# EAGLE design mSD-Shield-Mega_v10 (EAGLE 6.6.0)
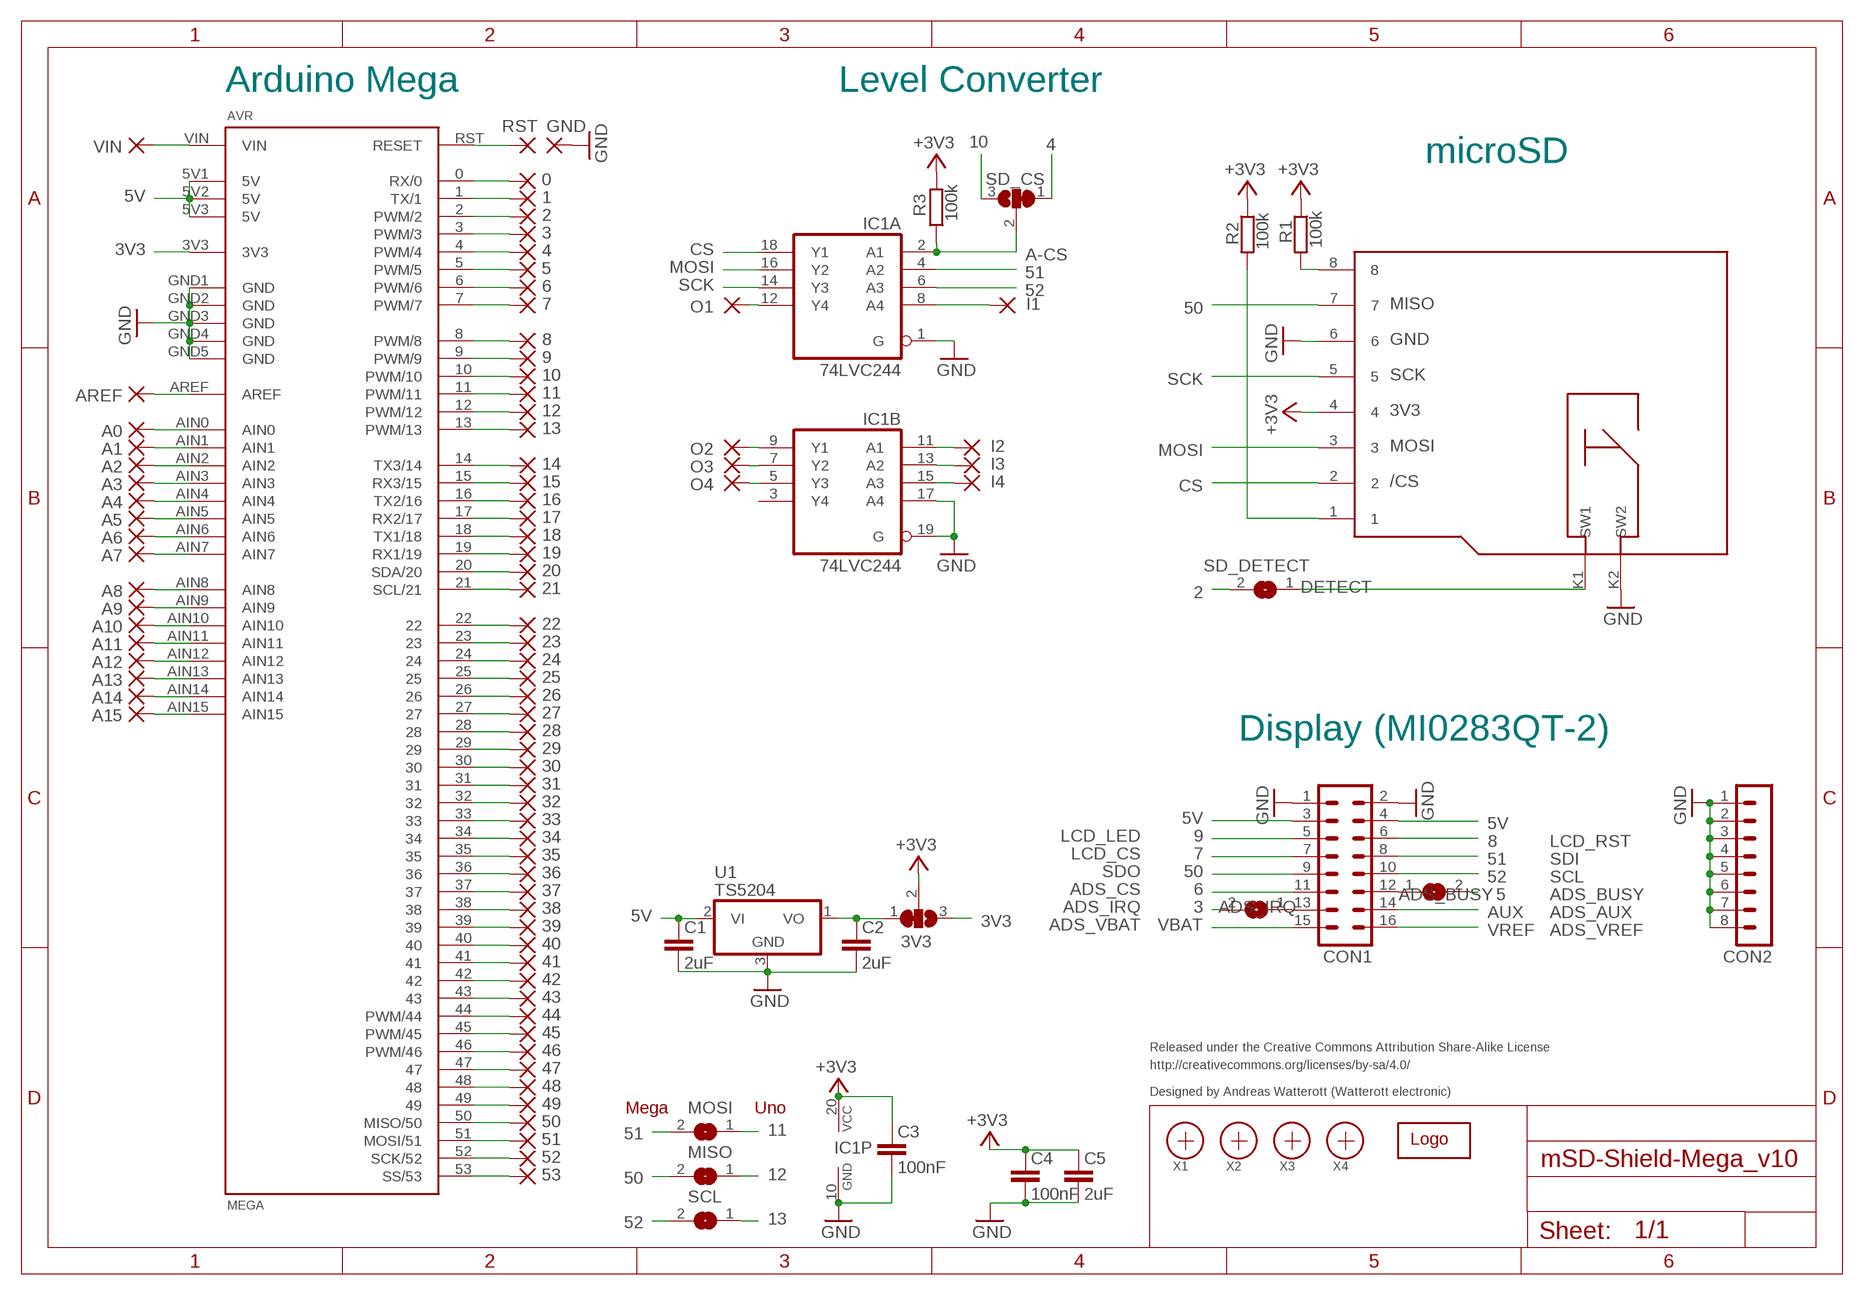
[diagram p0: schematic, sheet 1]

## Parts
0  1,6/0,8  [1,6/0,8]
1  1,6/0,8  [1,6/0,8]
2  1,6/0,8  [1,6/0,8]
3  1,6/0,8  [1,6/0,8]
3V3  SJ2W  [SJ_2]
4  1,6/0,8  [1,6/0,8]
5  1,6/0,8  [1,6/0,8]
6  1,6/0,8  [1,6/0,8]
7  1,6/0,8  [1,6/0,8]
8  1,6/0,8  [1,6/0,8]
9  1,6/0,8  [1,6/0,8]
10  1,6/0,8  [1,6/0,8]
11  1,6/0,8  [1,6/0,8]
12  1,6/0,8  [1,6/0,8]
13  1,6/0,8  [1,6/0,8]
14  1,6/0,8  [1,6/0,8]
15  1,6/0,8  [1,6/0,8]
16  1,6/0,8  [1,6/0,8]
17  1,6/0,8  [1,6/0,8]
18  1,6/0,8  [1,6/0,8]
19  1,6/0,8  [1,6/0,8]
20  1,6/0,8  [1,6/0,8]
21  1,6/0,8  [1,6/0,8]
22  1,6/0,8  [1,6/0,8]
23  1,6/0,8  [1,6/0,8]
24  1,6/0,8  [1,6/0,8]
25  1,6/0,8  [1,6/0,8]
26  1,6/0,8  [1,6/0,8]
27  1,6/0,8  [1,6/0,8]
28  1,6/0,8  [1,6/0,8]
29  1,6/0,8  [1,6/0,8]
30  1,6/0,8  [1,6/0,8]
31  1,6/0,8  [1,6/0,8]
32  1,6/0,8  [1,6/0,8]
33  1,6/0,8  [1,6/0,8]
34  1,6/0,8  [1,6/0,8]
35  1,6/0,8  [1,6/0,8]
36  1,6/0,8  [1,6/0,8]
37  1,6/0,8  [1,6/0,8]
38  1,6/0,8  [1,6/0,8]
39  1,6/0,8  [1,6/0,8]
40  1,6/0,8  [1,6/0,8]
41  1,6/0,8  [1,6/0,8]
42  1,6/0,8  [1,6/0,8]
43  1,6/0,8  [1,6/0,8]
44  1,6/0,8  [1,6/0,8]
45  1,6/0,8  [1,6/0,8]
46  1,6/0,8  [1,6/0,8]
47  1,6/0,8  [1,6/0,8]
48  1,6/0,8  [1,6/0,8]
49  1,6/0,8  [1,6/0,8]
50  1,6/0,8  [1,6/0,8]
51  1,6/0,8  [1,6/0,8]
52  1,6/0,8  [1,6/0,8]
53  1,6/0,8  [1,6/0,8]
A0  1,6/0,8  [1,6/0,8]
A1  1,6/0,8  [1,6/0,8]
A2  1,6/0,8  [1,6/0,8]
A3  1,6/0,8  [1,6/0,8]
A4  1,6/0,8  [1,6/0,8]
A5  1,6/0,8  [1,6/0,8]
A6  1,6/0,8  [1,6/0,8]
A7  1,6/0,8  [1,6/0,8]
A8  1,6/0,8  [1,6/0,8]
A9  1,6/0,8  [1,6/0,8]
A10  1,6/0,8  [1,6/0,8]
A11  1,6/0,8  [1,6/0,8]
A12  1,6/0,8  [1,6/0,8]
A13  1,6/0,8  [1,6/0,8]
A14  1,6/0,8  [1,6/0,8]
A15  1,6/0,8  [1,6/0,8]
ADS_BUSY  SJ  [SJ]
ADS_IRQ  SJ  [SJ]
AREF  1,6/0,8  [1,6/0,8]
AVR  MEGA  [MEGA]
C1  2uF  C-EUC0805  [C0805]
C2  2uF  C-EUC0805  [C0805]
C3  100nF  C-EUC0603  [C0603]
C4  100nF  C-EUC0603  [C0603]
C5  2uF  C-EUC0603  [C0603]
CON1  MA08-2  [MA08-2]
CON2  MA08-1  [MA08-1]
GND  SMD2  [SMD1,27-2,54]
I1  SMD2  [SMD1,27-2,54]
I2  SMD2  [SMD1,27-2,54]
I3  SMD2  [SMD1,27-2,54]
I4  SMD2  [SMD1,27-2,54]
IC1  74LVC244  74HC244DW  [SO20W]
MISO  SJ  [SJ]
MOSI  SJ  [SJ]
O1  SMD2  [SMD1,27-2,54]
O2  SMD2  [SMD1,27-2,54]
O3  SMD2  [SMD1,27-2,54]
O4  SMD2  [SMD1,27-2,54]
R1  100k  R-EU_R0603  [R0603]
R2  100k  R-EU_R0603  [R0603]
R3  100k  R-EU_R0603  [R0603]
RST  SMD2  [SMD1,27-2,54]
SCL  SJ  [SJ]
SD_CS  SJ2W  [SJ_2]
SD_DETECT  SJ  [SJ]
U1  TS5204  [SOT23]
U$1  WE-LOGO  [WE-LOGO]
VIN  1,6/0,8  [1,6/0,8]
X1  PASSER  [PASSER]
X2  PASSER  [PASSER]
X3  PASSER  [PASSER]
X4  PASSER  [PASSER]
X5  MICRO-SD  [MICRO-SD]

## Nets
0: 0.1(P) AVR.0(RX/0)
1: 1.1(P) AVR.1(TX/1)
2: 2.1(P) AVR.2(PWM/2) SD_DETECT.2
3: 3.1(P) ADS_IRQ.2 AVR.3(PWM/3)
3V3: 3V3.3 AVR.3V3
3V_OUT: 3V3.1 C2.1 U1.1(VO)
4: 4.1(P) AVR.4(PWM/4) SD_CS.1
5: 5.1(P) ADS_BUSY.2 AVR.5(PWM/5)
5V: AVR.5V1(5V) AVR.5V2(5V) AVR.5V3(5V) C1.1 CON1.3 CON1.4 U1.2(VI)
6: 6.1(P) AVR.6(PWM/6) CON1.11
7: 7.1(P) AVR.7(PWM/7) CON1.7
8: 8.1(P) AVR.8(PWM/8) CON1.6
9: 9.1(P) AVR.9(PWM/9) CON1.5
10: 10.1(P) AVR.10(PWM/10) SD_CS.3
11: 11.1(P) AVR.11(PWM/11) MOSI.1
12: 12.1(P) AVR.12(PWM/12) MISO.1
13: 13.1(P) AVR.13(PWM/13) SCL.1
14: 14.1(P) AVR.14(TX3/14)
15: 15.1(P) AVR.15(RX3/15)
16: 16.1(P) AVR.16(TX2/16)
17: 17.1(P) AVR.17(RX2/17)
18: 18.1(P) AVR.18(TX1/18)
19: 19.1(P) AVR.19(RX1/19)
20: 20.1(P) AVR.20(SDA/20)
21: 21.1(P) AVR.21(SCL/21)
22: 22.1(P) AVR.22
23: 23.1(P) AVR.23
24: 24.1(P) AVR.24
25: 25.1(P) AVR.25
26: 26.1(P) AVR.26
27: 27.1(P) AVR.27
28: 28.1(P) AVR.28
29: 29.1(P) AVR.29
30: 30.1(P) AVR.30
31: 31.1(P) AVR.31
32: 32.1(P) AVR.32
33: 33.1(P) AVR.33
34: 34.1(P) AVR.34
35: 35.1(P) AVR.35
36: 36.1(P) AVR.36
37: 37.1(P) AVR.37
38: 38.1(P) AVR.38
39: 39.1(P) AVR.39
40: 40.1(P) AVR.40
41: 41.1(P) AVR.41
42: 42.1(P) AVR.42
43: 43.1(P) AVR.43
44: 44.1(P) AVR.44(PWM/44)
45: 45.1(P) AVR.45(PWM/45)
46: 46.1(P) AVR.46(PWM/46)
47: 47.1(P) AVR.47
48: 48.1(P) AVR.48
49: 49.1(P) AVR.49
50: 50.1(P) AVR.50(MISO/50) CON1.9 MISO.2 X5.7
51: 51.1(P) AVR.51(MOSI/51) CON1.8 IC1.4(A:A2) MOSI.2
52: 52.1(P) AVR.52(SCK/52) CON1.10 IC1.6(A:A3) SCL.2
53: 53.1(P) AVR.53(SS/53)
+3V3: 3V3.2 C3.1 C4.1 C5.1 IC1.20(P:VCC) R1.1 R2.1 R3.2 X5.4
A-CS: IC1.2(A:A1) R3.1 SD_CS.2
ADS_BUSY: ADS_BUSY.1 CON1.12
ADS_IRQ: ADS_IRQ.1 CON1.13
AIN0: A0.1(P) AVR.AIN0
AIN1: A1.1(P) AVR.AIN1
AIN2: A2.1(P) AVR.AIN2
AIN3: A3.1(P) AVR.AIN3
AIN4: A4.1(P) AVR.AIN4
AIN5: A5.1(P) AVR.AIN5
AIN6: A6.1(P) AVR.AIN6
AIN7: A7.1(P) AVR.AIN7
AIN8: A8.1(P) AVR.AIN8
AIN9: A9.1(P) AVR.AIN9
AIN10: A10.1(P) AVR.AIN10
AIN11: A11.1(P) AVR.AIN11
AIN12: A12.1(P) AVR.AIN12
AIN13: A13.1(P) AVR.AIN13
AIN14: A14.1(P) AVR.AIN14
AIN15: A15.1(P) AVR.AIN15
AUX: CON1.14
CS: IC1.18(A:Y1) X5.2
DETECT: SD_DETECT.1 X5.K1(SW1)
GND: AVR.GND1(GND) AVR.GND2(GND) AVR.GND3(GND) AVR.GND4(GND) AVR.GND5(GND) C1.2 C2.2 C3.2 C4.2 C5.2 CON1.1 CON1.2 CON2.1 CON2.2 CON2.3 CON2.4 CON2.5 CON2.6 CON2.7 CON2.8 GND.1(P) IC1.1(A:G) IC1.10(P:GND) IC1.17(B:A4) IC1.19(B:G) U1.3(GND) X5.6 X5.K2(SW2)
I-1: I1.1(P) IC1.8(A:A4)
I-2: I2.1(P) IC1.11(B:A1)
I-3: I3.1(P) IC1.13(B:A2)
I-4: I4.1(P) IC1.15(B:A3)
MOSI: IC1.16(A:Y2) X5.3
N$16: R2.2 X5.1
N$17: R1.2 X5.8
N$18: AVR.VIN VIN.1(P)
N$50: AREF.1(P) AVR.AREF
O-1: IC1.12(A:Y4) O1.1(P)
O-2: IC1.9(B:Y1) O2.1(P)
O-3: IC1.7(B:Y2) O3.1(P)
O-4: IC1.5(B:Y3) O4.1(P)
RST: AVR.RST(RESET) RST.1(P)
SCK: IC1.14(A:Y3) X5.5
VBAT: CON1.15
VREF: CON1.16
Unconnected: IC1.3(B:Y4)

## Notes on the sheet
- Arduino Mega | Level Converter
- microSD
- Display (MI0283QT-2)
- LCD_LED
- LCD_CS | LCD_RST
- SDO | SDI
- ADS_CS | SCL
- ADS_IRQ | ADS_BUSY
- ADS_VBAT | ADS_AUX
- ADS_VREF
- Released under the Creative Commons Attribution Share-Alike License
- http://creativecommons.org/licenses/by-sa/4.0/
- Designed by Andreas Watterott (Watterott electronic)
- Mega | Uno

## Library data of the parts
0 1-53 A0 A1-A15 AREF VIN = wirepad:1,6/0,8: THROUGH-HOLE PAD
3V3 SD_CS = jumper:SJ2W: SMD solder JUMPER
ADS_BUSY ADS_IRQ MISO MOSI SCL SD_DETECT = jumper:SJ: SMD solder JUMPER
AVR = Arduino:MEGA: Arduino MEGA
C1-C5 = rcl:C-EU: CAPACITOR, European symbol
CON1 = con-lstb:MA08-2: PIN HEADER
CON2 = con-lstb:MA08-1: PIN HEADER
GND I1-I4 O1-O4 RST = wirepad:SMD2: SMD PAD
IC1 = 74xx-eu:74*244: Octal BUFFER and LINE DRIVER, 3-state
R1-R3 = rcl:R-EU_: RESISTOR, European symbol
U1 = Voltage-Reg:TS5204
U$1 = welectronic:WE-LOGO
X1-X4 = SMD:PASSER
X5 = SD-Card:MICRO-SD

## Board
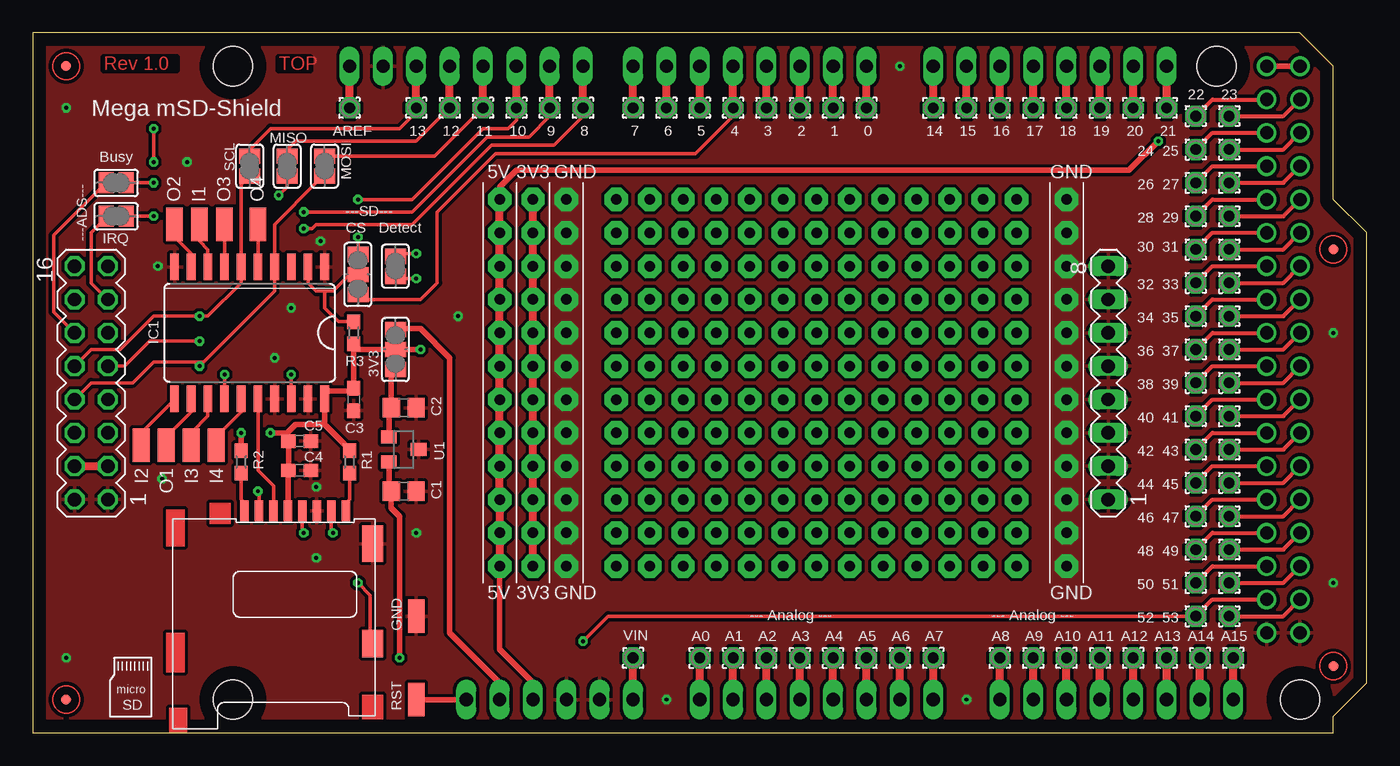
[diagram p1: board, top side]
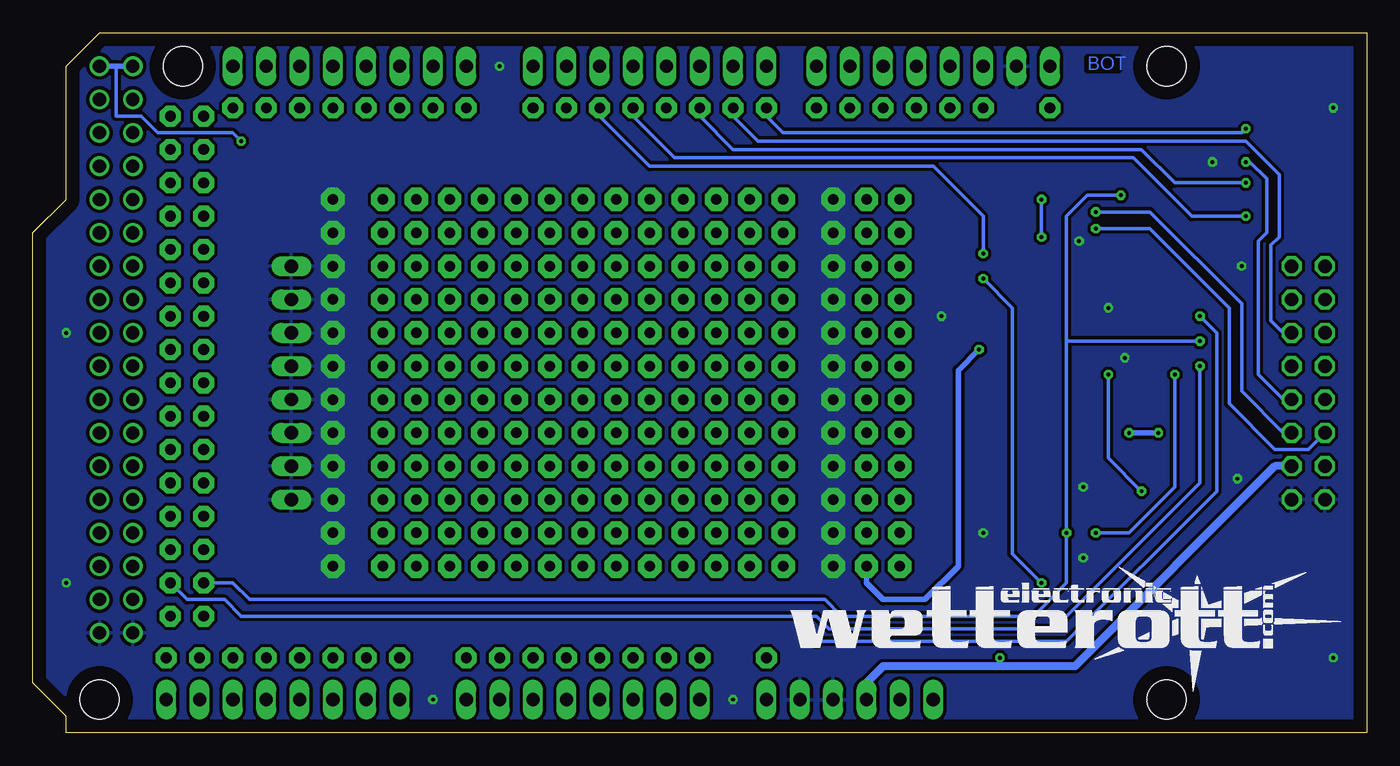
[diagram p2: board, bottom side, seen from below]

Size 101.6 x 53.34 mm. Coordinates in mm from the lower left corner, seen from the top.
Copper layers (1*16): Top 0.035mm / dielectric 1.5mm / Bottom 0.035mm
Design rules "default *": minimum track width 10mil, minimum drill 0.3mm, track to track 8mil, track to pad 8mil, pad to pad 8mil, via to via 8mil, smd to smd 8mil, copper to edge 40mil, drill to drill 8mil, minimum pad ring 10mil, minimum via ring 8mil, stop-mask expansion 4mil, vias tented up to drill 0.5mm, thermal gap 10mil

### Footprints (pad centres in the part's own frame; a part is rotated, then mirrored left to right if it is on the bottom)
1,6/0,8 = drill 0.813 pad 1.6 octagon: 1 0,0
SJ_2 = smd 1.168 x 1.6: 1 -1.524,0; 2 0,0; 3 1.524,0
SJ = smd 1.168 x 1.6: 1 -0.762,0; 2 0.762,0
MEGA = drill 1 long: 0 63.5,50.8; 1 60.96,50.8; 2 58.42,50.8; 3 55.88,50.8; 3V3 35.56,2.54; 4 53.34,50.8; 5 50.8,50.8; 5V1 38.1,2.54; 6 48.26,50.8; 7 45.72,50.8; 8 41.91,50.8; 9 39.37,50.8; 10 36.83,50.8; 11 34.29,50.8; 12 31.75,50.8; 13 29.21,50.8; 14 68.58,50.8; 15 71.12,50.8; 16 73.66,50.8; 17 76.2,50.8; 18 78.74,50.8; 19 81.28,50.8; 20 83.82,50.8; 21 86.36,50.8; AIN0 50.8,2.54; AIN1 53.34,2.54; AIN2 55.88,2.54; AIN3 58.42,2.54; AIN4 60.96,2.54; AIN5 63.5,2.54; AIN6 66.04,2.54; AIN7 68.58,2.54; AIN8 73.66,2.54; AIN9 76.2,2.54; AIN10 78.74,2.54; AIN11 81.28,2.54; AIN12 83.82,2.54; AIN13 86.36,2.54; AIN14 88.9,2.54; AIN15 91.44,2.54; AREF 24.13,50.8; GND1 40.64,2.54; GND2 43.18,2.54; GND3 26.67,50.8; RST 33.02,2.54; VIN 45.72,2.54 | drill 1: 5V2 93.98,50.8; 5V3 96.52,50.8; 22 93.98,48.26; 23 96.52,48.26; 24 93.98,45.72; 25 96.52,45.72; 26 93.98,43.18; 27 96.52,43.18; 28 93.98,40.64; 29 96.52,40.64; 30 93.98,38.1; 31 96.52,38.1; 32 93.98,35.56; 33 96.52,35.56; 34 93.98,33.02; 35 96.52,33.02; 36 93.98,30.48; 37 96.52,30.48; 38 93.98,27.94; 39 96.52,27.94; 40 93.98,25.4; 41 96.52,25.4; 42 93.98,22.86; 43 96.52,22.86; 44 93.98,20.32; 45 96.52,20.32; 46 93.98,17.78; 47 96.52,17.78; 48 93.98,15.24; 49 96.52,15.24; 50 93.98,12.7; 51 96.52,12.7; 52 93.98,10.16; 53 96.52,10.16; GND4 93.98,7.62; GND5 96.52,7.62 | hole 3: 90.17,50.8; 96.52,2.54; 15.24,50.8; 15.24,2.54
C0805 = smd 1.3 x 1.5: 1 -0.95,0; 2 0.95,0
C0603 = smd 1.1 x 1: 1 -0.85,0; 2 0.85,0
MA08-2 = drill 1.016 octagon: 1 -8.89,-1.27; 2 -8.89,1.27; 3 -6.35,-1.27; 4 -6.35,1.27; 5 -3.81,-1.27; 6 -3.81,1.27; 7 -1.27,-1.27; 8 -1.27,1.27; 9 1.27,-1.27; 10 1.27,1.27; 11 3.81,-1.27; 12 3.81,1.27; 13 6.35,-1.27; 14 6.35,1.27; 15 8.89,-1.27; 16 8.89,1.27
MA08-1 = drill 1.016 long: 1 -8.89,0; 2 -6.35,0; 3 -3.81,0; 4 -1.27,0; 5 1.27,0; 6 3.81,0; 7 6.35,0; 8 8.89,0
SMD1,27-2,54 = smd 1.27 x 2.54: 1 0,0
SO20W = smd 0.66 x 2.032: 1 -5.715,-5.029; 2 -4.445,-5.029; 3 -3.175,-5.029; 4 -1.905,-5.029; 5 -0.635,-5.029; 6 0.635,-5.029; 7 1.905,-5.029; 8 3.175,-5.029; 9 4.445,-5.029; 10 5.715,-5.029; 11 5.715,5.029; 12 4.445,5.029; 13 3.175,5.029; 14 1.905,5.029; 15 0.635,5.029; 16 -0.635,5.029; 17 -1.905,5.029; 18 -3.175,5.029; 19 -4.445,5.029; 20 -5.715,5.029
R0603 = smd 1.1 x 1: 1 -0.85,0; 2 0.85,0
SOT23 = smd 1 x 1.2: 1 -0.95,-1.132; 2 0.95,-1.132; 3 0,1.132
PASSER = smd 0.762 x 0.762: X 0,0
MICRO-SD = smd 0.65 x 1.6: 1 -10.54,16.6; 2 -9.44,16.6; 3 -8.34,16.6; 4 -7.24,16.6; 5 -6.14,16.6; 6 -5.04,16.6; 7 -3.94,16.6; 8 -2.84,16.6 | smd 1.6 x 2.1: K1 -0.8,6.5 | smd 1.6 x 2.8: K2 -0.8,14.1

### Placement (x,y rotation side)
0  63.5,47.62 0 top
1  60.96,47.62 0 top
2  58.42,47.62 0 top
3  55.88,47.62 0 top
3V3  27.62,29.21 90 top
4  53.34,47.62 0 top
5  50.8,47.62 0 top
6  48.26,47.62 0 top
7  45.72,47.62 0 top
8  41.91,47.62 0 top
9  39.37,47.62 0 top
10  36.83,47.62 0 top
11  34.29,47.62 0 top
12  31.75,47.62 0 top
13  29.21,47.62 0 top
14  68.58,47.62 180 top
15  71.12,47.62 180 top
16  73.66,47.62 180 top
17  76.2,47.62 180 top
18  78.74,47.62 180 top
19  81.28,47.62 180 top
20  83.82,47.62 180 top
21  86.36,47.62 180 top
22  88.58,46.99 90 top
23  91.12,46.99 90 top
24  88.58,44.45 90 top
25  91.12,44.45 90 top
26  88.58,41.91 90 top
27  91.12,41.91 90 top
28  88.58,39.37 90 top
29  91.12,39.37 90 top
30  88.58,36.83 90 top
31  91.12,36.83 90 top
32  88.58,34.29 90 top
33  91.12,34.29 90 top
34  88.58,31.75 90 top
35  91.12,31.75 90 top
36  88.58,29.21 90 top
37  91.12,29.21 90 top
38  88.58,26.67 90 top
39  91.12,26.67 90 top
40  88.58,24.13 90 top
41  91.12,24.13 90 top
42  88.58,21.59 90 top
43  91.12,21.59 90 top
44  88.58,19.05 90 top
45  91.12,19.05 90 top
46  88.58,16.51 90 top
47  91.12,16.51 90 top
48  88.58,13.97 90 top
49  91.12,13.97 90 top
50  88.58,11.43 90 top
51  91.12,11.43 90 top
52  88.58,8.89 90 top
53  91.12,8.89 90 top
A0  50.8,5.71 180 top
A1  53.34,5.71 180 top
A2  55.88,5.71 180 top
A3  58.42,5.71 180 top
A4  60.96,5.71 180 top
A5  63.5,5.71 180 top
A6  66.04,5.71 0 top
A7  68.58,5.71 0 top
A8  73.66,5.71 0 top
A9  76.2,5.71 0 top
A10  78.74,5.71 0 top
A11  81.28,5.71 0 top
A12  83.82,5.71 0 top
A13  86.36,5.71 0 top
A14  88.9,5.71 0 top
A15  91.44,5.71 0 top
ADS_BUSY  6.35,41.91 0 top
ADS_IRQ  6.35,39.37 0 top
AREF  24.13,47.62 0 top
AVR  0,0 0 top
C1  28.26,18.41 0 top
C2  28.26,24.77 0 top
C3  24.45,25.4 270 top
C4  20.32,20 0 top
C5  20.32,22.23 0 top
CON1  4.45,26.67 90 top
CON2  81.92,26.67 90 top
GND  29.21,8.89 0 top
I1  12.7,38.73 0 top
I2  8.26,21.91 0 top
I3  12.06,21.91 0 top
I4  13.97,21.91 0 top
IC1  16.51,30.48 180 top
MISO  19.37,43.18 270 top
MOSI  22.23,43.18 270 top
O1  10.16,21.91 0 top
O2  10.79,38.73 0 top
O3  14.61,38.73 0 top
O4  17.14,38.73 0 top
R1  24.13,20.64 270 top
R2  15.88,20.64 270 top
R3  24.45,30.48 270 top
RST  29.21,2.54 0 top
SCL  16.51,43.18 270 top
SD_CS  24.77,34.92 90 top
SD_DETECT  27.62,35.56 90 top
U1  28.26,21.59 270 top
U$1  44.13,2.86 0 bottom
VIN  45.72,5.71 0 top
X1  2.54,2.54 0 top
X2  2.54,50.8 0 top
X3  99.06,36.83 0 top
X4  99.06,5.08 0 top
X5  26.67,0.32 0 top

### Tracks (layer width: path | path; a pad name or v marks a point on that pad's centre or on a via)
0
  Top 0.61: 0.1 AVR.0
1
  Top 0.61: 1.1 AVR.1
2  (via drill 0.3)
  Top 0.254: v29.21,36.51 27.81,36.51 SD_DETECT.2
  Top 0.61: 2.1 AVR.2
  Bottom 0.254: v29.21,36.51 29.21,39.37 33.02,43.18 54.61,43.18 58.42,46.99 2.1
3  (via drill 0.3)
  Top 0.254: ADS_IRQ.2 v9.21,39.37
  Top 0.61: 3.1 AVR.3
  Bottom 0.254: v9.21,39.37 13.34,39.37 17.78,43.81 52.7,43.81 55.88,46.99 3.1
3V3
  Top 0.254: 27.69,30.8 3V3.3
  Top 0.406: 27.69,30.8 29.53,30.8 31.75,28.57 31.75,7.62 35.56,3.81 AVR.3V3
3V_OUT
  Top 0.254: 27.13,24.58 C2.1 | 27.31,27.37 3V3.1
  Top 0.406: U1.1 27.13,24.58 | C2.1 27.31,27.37
4
  Top 0.254: SD_CS.1 24.77,33.02 29.53,33.02 30.8,34.29 30.8,39.69 35.24,44.13 50.48,44.13 53.34,46.99 4.1
  Top 0.61: 4.1 AVR.4
5  (via drill 0.3)
  Top 0.254: ADS_BUSY.2 v9.21,41.91
  Top 0.61: 5.1 AVR.5
  Bottom 0.254: v9.21,41.91 14.61,41.91 17.14,44.45 48.26,44.45 50.8,46.99 5.1
5V  (via drill 0.3, 0.8 pad 1.78)
  Top 0.254: C1.1 27.13,18.6
  Top 0.406: 27.13,18.6 U1.2 | C1.1 27.31,17.14 27.94,16.51 v27.94,5.71 | v35.56,17.78 35.56,6.35 38.1,3.81 AVR.5V1 | AVR.5V2 AVR.5V3 | v35.56,40.64 35.56,41.59 36.83,42.86 83.5,42.86 v85.72,45.09
  Top 0.61: CON1.4 CON1.3 | v35.56,12.7 v35.56,15.24 v35.56,17.78 v35.56,20.32 v35.56,22.86 v35.56,25.4 v35.56,27.94 v35.56,30.48 v35.56,33.02 v35.56,35.56 v35.56,38.1 v35.56,40.64
  Bottom 0.254: 95.25,50.8 95.25,46.99 93.34,46.99 92.08,45.72 86.36,45.72 v85.72,45.09
  Bottom 0.406: AVR.5V2 95.25,50.8 AVR.5V3 | 27.94,5.08 v27.94,5.71
  Bottom 0.61: CON1.3 6.99,20.32 22.23,5.08 27.94,5.08 36.83,5.08 38.1,3.81 AVR.5V1
6
  Top 0.61: 6.1 AVR.6
  Bottom 0.254: CON1.11 6.35,30.48 7.3,31.43 7.3,37.15 6.67,37.78 6.67,42.55 9.21,45.09 46.35,45.09 48.26,46.99 6.1
7  (via drill 0.3)
  Top 0.254: v9.21,43.5 v9.21,46.04
  Top 0.61: 7.1 AVR.7
  Bottom 0.254: CON1.7 6.35,25.4 8.26,27.3 8.26,37.47 7.62,38.1 7.62,42.23 8.89,43.5 v9.21,43.5 | v9.21,46.04 9.53,45.72 44.45,45.72 45.72,46.99 7.1
8  (via drill 0.3)
  Top 0.254: v20.64,38.42 21.27,38.42 21.59,38.73 28.89,38.73 34.92,44.77 39.69,44.77 41.91,46.99 8.1
  Top 0.61: 8.1 AVR.8
  Bottom 0.254: CON1.6 4.45,21.59 6.99,21.59 10.48,25.08 10.48,32.38 16.51,38.42 v20.64,38.42
9  (via drill 0.3)
  Top 0.254: v20.64,39.69 28.89,39.69 34.61,45.4 37.78,45.4 39.37,46.99 9.1
  Top 0.61: 9.1 AVR.9
  Bottom 0.254: CON1.5 6.35,22.86 9.53,26.04 9.53,32.7 16.51,39.69 v20.64,39.69
10  (via drill 0.3)
  Top 0.254: v24.77,40.64 28.89,40.64 34.29,46.04 36.2,46.04 36.83,46.67 10.1 | SD_CS.3 v24.77,37.78
  Top 0.61: 10.1 AVR.10
  Bottom 0.254: v24.77,37.78 v24.77,40.64
11
  Top 0.254: MOSI.1 30.61,43.94 11.1
  Top 0.61: 11.1 AVR.11
12
  Top 0.254: MISO.1 19.37,44.45 20,45.09 29.21,45.09 12.1
  Top 0.61: 12.1 AVR.12
13
  Top 0.254: 13.1 29.21,47.31 27.94,46.04 18.1,46.04 16.51,44.45 SCL.1
  Top 0.61: 13.1 AVR.13
14
  Top 0.61: 14.1 AVR.14
15
  Top 0.61: 15.1 AVR.15
16
  Top 0.61: 16.1 AVR.16
17
  Top 0.61: 17.1 AVR.17
18
  Top 0.61: 18.1 AVR.18
19
  Top 0.61: 19.1 AVR.19
20
  Top 0.61: 20.1 AVR.20
21
  Top 0.61: 21.1 AVR.21
22
  Top 0.305: 22.1 89.85,48.26 AVR.22
23
  Top 0.305: 23.1 95.25,46.99 AVR.23
24
  Top 0.305: 24.1 89.85,45.72 AVR.24
25
  Top 0.305: 25.1 95.25,44.45 AVR.25
26
  Top 0.305: 26.1 89.85,43.18 AVR.26
27
  Top 0.305: 27.1 95.25,41.91 AVR.27
28
  Top 0.305: 28.1 89.85,40.64 AVR.28
29
  Top 0.305: 29.1 95.25,39.37 AVR.29
30
  Top 0.305: AVR.30 89.85,38.1 30.1
31
  Top 0.305: 31.1 95.25,36.83 AVR.31
32
  Top 0.305: AVR.32 89.85,35.56 32.1
33
  Top 0.305: 33.1 95.25,34.29 AVR.33
34
  Top 0.305: AVR.34 89.85,33.02 34.1
35
  Top 0.305: 35.1 95.25,31.75 AVR.35
36
  Top 0.305: AVR.36 89.85,30.48 36.1
37
  Top 0.305: 37.1 95.25,29.21 AVR.37
38
  Top 0.305: AVR.38 89.85,27.94 38.1
39
  Top 0.305: 39.1 95.25,26.67 AVR.39
40
  Top 0.305: AVR.40 89.85,25.4 40.1
41
  Top 0.305: 41.1 95.25,24.13 AVR.41
42
  Top 0.305: AVR.42 89.85,22.86 42.1
43
  Top 0.305: 43.1 95.25,21.59 AVR.43
44
  Top 0.305: AVR.44 89.85,20.32 44.1
45
  Top 0.305: 45.1 95.25,19.05 AVR.45
46
  Top 0.305: AVR.46 89.85,17.78 46.1
47
  Top 0.305: 47.1 95.25,16.51 AVR.47
48
  Top 0.305: AVR.48 89.85,15.24 48.1
49
  Top 0.305: 49.1 95.25,13.97 AVR.49
50  (via drill 0.3)
  Top 0.254: CON1.9 6.99,27.94 8.89,29.84 v12.7,29.84 | X5.7 22.73,15.37 v22.86,15.24 | v18.73,40.96 19.37,41.59 MISO.2
  Top 0.305: AVR.50 89.85,12.7 50.1
  Bottom 0.254: 50.1 86.36,11.43 85.09,10.16 41.27,10.16 40.01,8.89 25.4,8.89 22.86,11.43 v22.86,15.24 22.86,29.84 | v12.7,29.84 22.86,29.84 | 22.86,29.84 22.86,39.37 21.27,40.96 v18.73,40.96
51  (via drill 0.3)
  Top 0.254: CON1.8 4.45,26.67 7.62,26.67 9.21,28.26 12.7,28.26 | 12.7,28.26 13.02,28.26 18.41,33.66 IC1.4 18.41,38.73 21.59,41.91 21.59,42.23 21.91,42.55 22.1,42.55 MOSI.2 | 12.7,28.26 v12.7,27.94
  Top 0.305: 51.1 95.25,11.43 AVR.51
  Bottom 0.254: 51.1 89.85,10.16 87,10.16 85.72,8.89 41.91,8.89 40.96,7.94 23.81,7.94 12.7,19.05 v12.7,27.94
52  (via drill 0.3)
  Top 0.254: CON1.10 4.45,29.21 6.67,29.21 9.21,31.75 v12.7,31.75 13.34,31.75 15.88,34.29 IC1.6 15.88,41.78 SCL.2 | v41.91,6.99 43.81,8.89 52.1
  Top 0.305: 52.1 89.85,10.16 AVR.52
  Bottom 0.254: v41.91,6.99 22.86,6.99 11.43,18.41 11.43,30.48 v12.7,31.75
53
  Top 0.305: 53.1 95.25,8.89 AVR.53
+3V3  (via drill 0.3, 0.8 pad 1.78)
  Top 0.254: 19.43,19.96 C4.1 | C5.1 19.37,22.23 | 24.45,29.21 R3.2 | IC1.20 22.23,26.04 | 24.23,26.04 C3.1 | 24.13,21.59 R1.1 | 3V3.2 27.62,27.62
  Top 0.406: X5.4 19.43,19.96 | C4.1 C5.1 | v15.88,22.86 R2.1 | 19.37,22.23 19.37,22.86 | 19.37,22.86 20,23.5 22.23,23.5 | 22.23,23.5 IC1.20 | C3.1 24.45,29.21 3V3.2 v29.53,29.21 | 22.23,26.04 24.23,26.04 | 22.23,23.5 24.13,21.59 | 19.37,22.86 v18.1,22.86
  Top 0.61: v38.1,12.7 v38.1,15.24 v38.1,17.78 v38.1,20.32 v38.1,22.86 v38.1,25.4 v38.1,27.94 v38.1,30.48 v38.1,33.02 v38.1,35.56 v38.1,38.1 v38.1,40.64
  Bottom 0.406: v18.1,22.86 v15.88,22.86 | v29.53,29.21 31.11,27.62 31.11,12.7 33.66,10.16 36.83,10.16 38.1,11.43 v38.1,12.7
A-CS
  Top 0.254: 22.23,33.66 21.59,33.66 20.95,34.29 IC1.2 | 22.23,33.66 22.86,33.66 24.13,34.92 SD_CS.2 24.77,33.34 | R3.1 23.28,31.33 22.23,32.38 22.23,33.66
ADS_BUSY
  Top 0.254: CON1.12 1.59,32.07 1.59,37.91 ADS_BUSY.1
ADS_IRQ
  Top 0.254: CON1.13 4.45,34.29 4.45,38.1 5.4,39.05 5.4,39.18 ADS_IRQ.1
AIN0
  Top 0.61: AVR.AIN0 A0.1
AIN1
  Top 0.61: AVR.AIN1 A1.1
AIN2
  Top 0.61: AVR.AIN2 A2.1
AIN3
  Top 0.61: AVR.AIN3 A3.1
AIN4
  Top 0.61: AVR.AIN4 A4.1
AIN5
  Top 0.61: AVR.AIN5 A5.1
AIN6
  Top 0.61: AVR.AIN6 A6.1
AIN7
  Top 0.61: AVR.AIN7 A7.1
AIN8
  Top 0.61: AVR.AIN8 A8.1
AIN9
  Top 0.61: AVR.AIN9 A9.1
AIN10
  Top 0.61: AVR.AIN10 A10.1
AIN11
  Top 0.61: AVR.AIN11 A11.1
AIN12
  Top 0.61: AVR.AIN12 A12.1
AIN13
  Top 0.61: AVR.AIN13 A13.1
AIN14
  Top 0.61: AVR.AIN14 A14.1
AIN15
  Top 0.61: AVR.AIN15 A15.1
CS  (via drill 0.3)
  Top 0.254: v19.68,27.3 IC1.18 | X5.2 17.23,18.33 v17.14,18.41
  Bottom 0.254: v17.14,18.41 19.68,20.95 v19.68,27.3
DETECT  (via drill 0.3)
  Top 0.254: SD_DETECT.1 27.62,34.61 v29.21,34.61 | v24.77,11.43 25.7,10.49 25.7,6.67 X5.K1
  Bottom 0.254: v29.21,34.61 26.99,32.38 26.99,13.65 v24.77,11.43
GND  (via drill 0.3, 0.8 pad 1.78)
  other vias: 21.59,18.73 40.64,40.64 40.64,38.1 40.64,35.56 40.64,33.02 40.64,12.7 40.64,15.24 40.64,17.78 40.64,20.32 40.64,22.86 40.64,25.4 40.64,27.94 40.64,30.48 19.68,32.38 21.91,37.47 9.53,35.56 9.84,19.37 21.59,13.34 2.54,47.62 11.75,43.5 66.04,50.8 2.54,5.71 99.06,11.43 99.06,30.48 78.74,40.64 78.74,38.1 78.74,35.56 78.74,33.02 78.74,12.7 78.74,15.24 78.74,17.78 78.74,20.32 78.74,22.86 78.74,25.4 78.74,27.94 78.74,30.48 71.12,2.54 48.26,2.54 18.41,28.57 32.38,31.75 29.21,15.24
  pour Bottom (isolate 0.254): 0,53.34 101.6,53.34 101.6,0 0,0
  pour Top (isolate 0.254): 0,0 0,53.34 101.6,53.34 101.6,0
I-1
  Top 0.254: IC1.8 13.34,36.83 12.7,37.47 I1.1
I-2
  Top 0.254: IC1.11 10.79,25.4 8.26,22.86 I2.1
I-3
  Top 0.254: IC1.13 13.34,24.13 12.06,22.86 I3.1
I-4
  Top 0.254: IC1.15 15.88,24.45 13.97,22.54 I4.1
MOSI
  Top 0.254: X5.3 18.33,18.82 17.14,20 IC1.16
N$1  (via drill 0.8 pad 1.78)
  other vias: 64.77,38.1
N$2  (via drill 0.8 pad 1.78)
  other vias: 67.31,38.1
N$3  (via drill 0.8 pad 1.78)
  other vias: 74.93,38.1
N$4  (via drill 0.8 pad 1.78)
  other vias: 72.39,38.1
N$5  (via drill 0.8 pad 1.78)
  other vias: 69.85,38.1
N$6  (via drill 0.8 pad 1.78)
  other vias: 64.77,33.02
N$7  (via drill 0.8 pad 1.78)
  other vias: 67.31,33.02
N$8  (via drill 0.8 pad 1.78)
  other vias: 62.23,38.1
N$9  (via drill 0.8 pad 1.78)
  other vias: 59.69,38.1
N$10  (via drill 0.8 pad 1.78)
  other vias: 57.15,38.1
N$11  (via drill 0.8 pad 1.78)
  other vias: 54.61,38.1
N$12  (via drill 0.8 pad 1.78)
  other vias: 52.07,38.1
N$13  (via drill 0.8 pad 1.78)
  other vias: 49.53,38.1
N$14  (via drill 0.8 pad 1.78)
  other vias: 46.99,38.1
N$15  (via drill 0.8 pad 1.78)
  other vias: 44.45,38.1
N$16
  Top 0.254: X5.1 16.13,17.52 15.88,17.78 R2.2
N$17
  Top 0.254: X5.8 23.83,17.48 24.13,17.78 R1.2
N$18
  Top 0.61: AVR.VIN VIN.1
N$19  (via drill 0.8 pad 1.78)
  other vias: 64.77,35.56
N$20  (via drill 0.8 pad 1.78)
  other vias: 67.31,35.56
N$21  (via drill 0.8 pad 1.78)
  other vias: 74.93,40.64
N$22  (via drill 0.8 pad 1.78)
  other vias: 72.39,40.64
N$23  (via drill 0.8 pad 1.78)
  other vias: 69.85,40.64
N$24  (via drill 0.8 pad 1.78)
  other vias: 67.31,40.64
N$25  (via drill 0.8 pad 1.78)
  other vias: 64.77,40.64
N$26  (via drill 0.8 pad 1.78)
  other vias: 62.23,40.64
N$27  (via drill 0.8 pad 1.78)
  other vias: 59.69,40.64
N$28  (via drill 0.8 pad 1.78)
  other vias: 57.15,40.64
N$29  (via drill 0.8 pad 1.78)
  other vias: 54.61,40.64
N$30  (via drill 0.8 pad 1.78)
  other vias: 52.07,40.64
N$31  (via drill 0.8 pad 1.78)
  other vias: 49.53,40.64
N$32  (via drill 0.8 pad 1.78)
  other vias: 46.99,40.64
N$33  (via drill 0.8 pad 1.78)
  other vias: 44.45,40.64
N$37  (via drill 0.8 pad 1.78)
  other vias: 74.93,12.7
N$38  (via drill 0.8 pad 1.78)
  other vias: 72.39,12.7
N$39  (via drill 0.8 pad 1.78)
  other vias: 69.85,12.7
N$40  (via drill 0.8 pad 1.78)
  other vias: 67.31,12.7
N$41  (via drill 0.8 pad 1.78)
  other vias: 64.77,12.7
N$42  (via drill 0.8 pad 1.78)
  other vias: 62.23,12.7
N$43  (via drill 0.8 pad 1.78)
  other vias: 59.69,12.7
N$44  (via drill 0.8 pad 1.78)
  other vias: 57.15,12.7
N$45  (via drill 0.8 pad 1.78)
  other vias: 54.61,12.7
N$46  (via drill 0.8 pad 1.78)
  other vias: 52.07,12.7
N$47  (via drill 0.8 pad 1.78)
  other vias: 49.53,12.7
N$48  (via drill 0.8 pad 1.78)
  other vias: 46.99,12.7
N$49  (via drill 0.8 pad 1.78)
  other vias: 44.45,12.7
N$50
  Top 0.61: AREF.1 AVR.AREF
N$53  (via drill 0.8 pad 1.78)
  other vias: 74.93,35.56
N$54  (via drill 0.8 pad 1.78)
  other vias: 72.39,35.56
N$55  (via drill 0.8 pad 1.78)
  other vias: 69.85,35.56
N$58  (via drill 0.8 pad 1.78)
  other vias: 62.23,35.56
N$59  (via drill 0.8 pad 1.78)
  other vias: 59.69,35.56
N$60  (via drill 0.8 pad 1.78)
  other vias: 57.15,35.56
N$61  (via drill 0.8 pad 1.78)
  other vias: 54.61,35.56
N$62  (via drill 0.8 pad 1.78)
  other vias: 52.07,35.56
N$63  (via drill 0.8 pad 1.78)
  other vias: 49.53,35.56
N$64  (via drill 0.8 pad 1.78)
  other vias: 46.99,35.56
N$65  (via drill 0.8 pad 1.78)
  other vias: 44.45,35.56
N$69  (via drill 0.8 pad 1.78)
  other vias: 74.93,33.02
N$70  (via drill 0.8 pad 1.78)
  other vias: 72.39,33.02
N$71  (via drill 0.8 pad 1.78)
  other vias: 69.85,33.02
N$74  (via drill 0.8 pad 1.78)
  other vias: 62.23,33.02
N$75  (via drill 0.8 pad 1.78)
  other vias: 59.69,33.02
N$76  (via drill 0.8 pad 1.78)
  other vias: 57.15,33.02
N$77  (via drill 0.8 pad 1.78)
  other vias: 54.61,33.02
N$78  (via drill 0.8 pad 1.78)
  other vias: 52.07,33.02
N$79  (via drill 0.8 pad 1.78)
  other vias: 49.53,33.02
N$80  (via drill 0.8 pad 1.78)
  other vias: 46.99,33.02
N$81  (via drill 0.8 pad 1.78)
  other vias: 44.45,33.02
N$85  (via drill 0.8 pad 1.78)
  other vias: 74.93,30.48
N$86  (via drill 0.8 pad 1.78)
  other vias: 72.39,30.48
N$87  (via drill 0.8 pad 1.78)
  other vias: 69.85,30.48
N$88  (via drill 0.8 pad 1.78)
  other vias: 67.31,30.48
N$89  (via drill 0.8 pad 1.78)
  other vias: 64.77,30.48
N$90  (via drill 0.8 pad 1.78)
  other vias: 62.23,30.48
N$91  (via drill 0.8 pad 1.78)
  other vias: 59.69,30.48
N$92  (via drill 0.8 pad 1.78)
  other vias: 57.15,30.48
N$93  (via drill 0.8 pad 1.78)
  other vias: 54.61,30.48
N$94  (via drill 0.8 pad 1.78)
  other vias: 52.07,30.48
N$95  (via drill 0.8 pad 1.78)
  other vias: 49.53,30.48
N$96  (via drill 0.8 pad 1.78)
  other vias: 46.99,30.48
N$97  (via drill 0.8 pad 1.78)
  other vias: 44.45,30.48
N$101  (via drill 0.8 pad 1.78)
  other vias: 74.93,27.94
N$102  (via drill 0.8 pad 1.78)
  other vias: 72.39,27.94
N$103  (via drill 0.8 pad 1.78)
  other vias: 69.85,27.94
N$104  (via drill 0.8 pad 1.78)
  other vias: 67.31,27.94
N$105  (via drill 0.8 pad 1.78)
  other vias: 64.77,27.94
N$106  (via drill 0.8 pad 1.78)
  other vias: 62.23,27.94
N$107  (via drill 0.8 pad 1.78)
  other vias: 59.69,27.94
N$108  (via drill 0.8 pad 1.78)
  other vias: 57.15,27.94
N$109  (via drill 0.8 pad 1.78)
  other vias: 54.61,27.94
N$110  (via drill 0.8 pad 1.78)
  other vias: 52.07,27.94
N$111  (via drill 0.8 pad 1.78)
  other vias: 49.53,27.94
N$112  (via drill 0.8 pad 1.78)
  other vias: 46.99,27.94
N$113  (via drill 0.8 pad 1.78)
  other vias: 44.45,27.94
N$117  (via drill 0.8 pad 1.78)
  other vias: 74.93,25.4
N$118  (via drill 0.8 pad 1.78)
  other vias: 72.39,25.4
N$119  (via drill 0.8 pad 1.78)
  other vias: 69.85,25.4
N$120  (via drill 0.8 pad 1.78)
  other vias: 67.31,25.4
N$121  (via drill 0.8 pad 1.78)
  other vias: 64.77,25.4
N$122  (via drill 0.8 pad 1.78)
  other vias: 62.23,25.4
N$123  (via drill 0.8 pad 1.78)
  other vias: 59.69,25.4
N$124  (via drill 0.8 pad 1.78)
  other vias: 57.15,25.4
N$125  (via drill 0.8 pad 1.78)
  other vias: 54.61,25.4
N$126  (via drill 0.8 pad 1.78)
  other vias: 52.07,25.4
N$127  (via drill 0.8 pad 1.78)
  other vias: 49.53,25.4
N$128  (via drill 0.8 pad 1.78)
  other vias: 46.99,25.4
N$129  (via drill 0.8 pad 1.78)
  other vias: 44.45,25.4
N$133  (via drill 0.8 pad 1.78)
  other vias: 74.93,22.86
N$134  (via drill 0.8 pad 1.78)
  other vias: 72.39,22.86
N$135  (via drill 0.8 pad 1.78)
  other vias: 69.85,22.86
N$136  (via drill 0.8 pad 1.78)
  other vias: 67.31,22.86
N$137  (via drill 0.8 pad 1.78)
  other vias: 64.77,22.86
N$138  (via drill 0.8 pad 1.78)
  other vias: 62.23,22.86
N$139  (via drill 0.8 pad 1.78)
  other vias: 59.69,22.86
N$140  (via drill 0.8 pad 1.78)
  other vias: 57.15,22.86
N$141  (via drill 0.8 pad 1.78)
  other vias: 54.61,22.86
N$142  (via drill 0.8 pad 1.78)
  other vias: 52.07,22.86
N$143  (via drill 0.8 pad 1.78)
  other vias: 49.53,22.86
N$144  (via drill 0.8 pad 1.78)
  other vias: 46.99,22.86
N$145  (via drill 0.8 pad 1.78)
  other vias: 44.45,22.86
N$149  (via drill 0.8 pad 1.78)
  other vias: 74.93,20.32
N$150  (via drill 0.8 pad 1.78)
  other vias: 72.39,20.32
N$151  (via drill 0.8 pad 1.78)
  other vias: 69.85,20.32
N$152  (via drill 0.8 pad 1.78)
  other vias: 67.31,20.32
N$153  (via drill 0.8 pad 1.78)
  other vias: 64.77,20.32
N$154  (via drill 0.8 pad 1.78)
  other vias: 62.23,20.32
N$155  (via drill 0.8 pad 1.78)
  other vias: 59.69,20.32
N$156  (via drill 0.8 pad 1.78)
  other vias: 57.15,20.32
N$157  (via drill 0.8 pad 1.78)
  other vias: 54.61,20.32
N$158  (via drill 0.8 pad 1.78)
  other vias: 52.07,20.32
N$159  (via drill 0.8 pad 1.78)
  other vias: 49.53,20.32
N$160  (via drill 0.8 pad 1.78)
  other vias: 46.99,20.32
N$161  (via drill 0.8 pad 1.78)
  other vias: 44.45,20.32
N$165  (via drill 0.8 pad 1.78)
  other vias: 74.93,17.78
N$166  (via drill 0.8 pad 1.78)
  other vias: 72.39,17.78
N$167  (via drill 0.8 pad 1.78)
  other vias: 69.85,17.78
N$168  (via drill 0.8 pad 1.78)
  other vias: 67.31,17.78
N$169  (via drill 0.8 pad 1.78)
  other vias: 64.77,17.78
N$170  (via drill 0.8 pad 1.78)
  other vias: 62.23,17.78
N$171  (via drill 0.8 pad 1.78)
  other vias: 59.69,17.78
N$172  (via drill 0.8 pad 1.78)
  other vias: 57.15,17.78
N$173  (via drill 0.8 pad 1.78)
  other vias: 54.61,17.78
N$174  (via drill 0.8 pad 1.78)
  other vias: 52.07,17.78
N$175  (via drill 0.8 pad 1.78)
  other vias: 49.53,17.78
N$176  (via drill 0.8 pad 1.78)
  other vias: 46.99,17.78
N$177  (via drill 0.8 pad 1.78)
  other vias: 44.45,17.78
N$181  (via drill 0.8 pad 1.78)
  other vias: 74.93,15.24
N$182  (via drill 0.8 pad 1.78)
  other vias: 72.39,15.24
N$183  (via drill 0.8 pad 1.78)
  other vias: 69.85,15.24
N$184  (via drill 0.8 pad 1.78)
  other vias: 67.31,15.24
N$185  (via drill 0.8 pad 1.78)
  other vias: 64.77,15.24
N$186  (via drill 0.8 pad 1.78)
  other vias: 62.23,15.24
N$187  (via drill 0.8 pad 1.78)
  other vias: 59.69,15.24
N$188  (via drill 0.8 pad 1.78)
  other vias: 57.15,15.24
N$189  (via drill 0.8 pad 1.78)
  other vias: 54.61,15.24
N$190  (via drill 0.8 pad 1.78)
  other vias: 52.07,15.24
N$191  (via drill 0.8 pad 1.78)
  other vias: 49.53,15.24
N$192  (via drill 0.8 pad 1.78)
  other vias: 46.99,15.24
N$193  (via drill 0.8 pad 1.78)
  other vias: 44.45,15.24
O-1
  Top 0.254: IC1.12 12.06,24.45 10.16,22.54 O1.1
O-2
  Top 0.254: IC1.9 12.06,36.51 10.79,37.78 O2.1
O-3
  Top 0.254: IC1.7 O3.1
O-4
  Top 0.254: IC1.5 O4.1
RST
  Top 0.406: RST.1 AVR.RST
SCK  (via drill 0.3)
  Top 0.254: v14.61,27.3 IC1.14 | X5.5 20.53,15.35 v20.64,15.24
  Bottom 0.254: v14.61,27.3 14.61,18.73 18.1,15.24 v20.64,15.24

### Text on the board
Top: Rev 1.0 | TOP
Bottom: BOT
tPlace: Busy | ---SD--- | IRQ | CS | Detect | ---ADS--- | --- Analog --- | --- Analog --- | micro | SD
tNames: Mega mSD-Shield | 5V | 3V3 | GND | GND | 5V | 3V3 | GND | GND